# EAGLE design DAQ and eCVT (EAGLE 9.5.0)

## Sheet 1 of 3
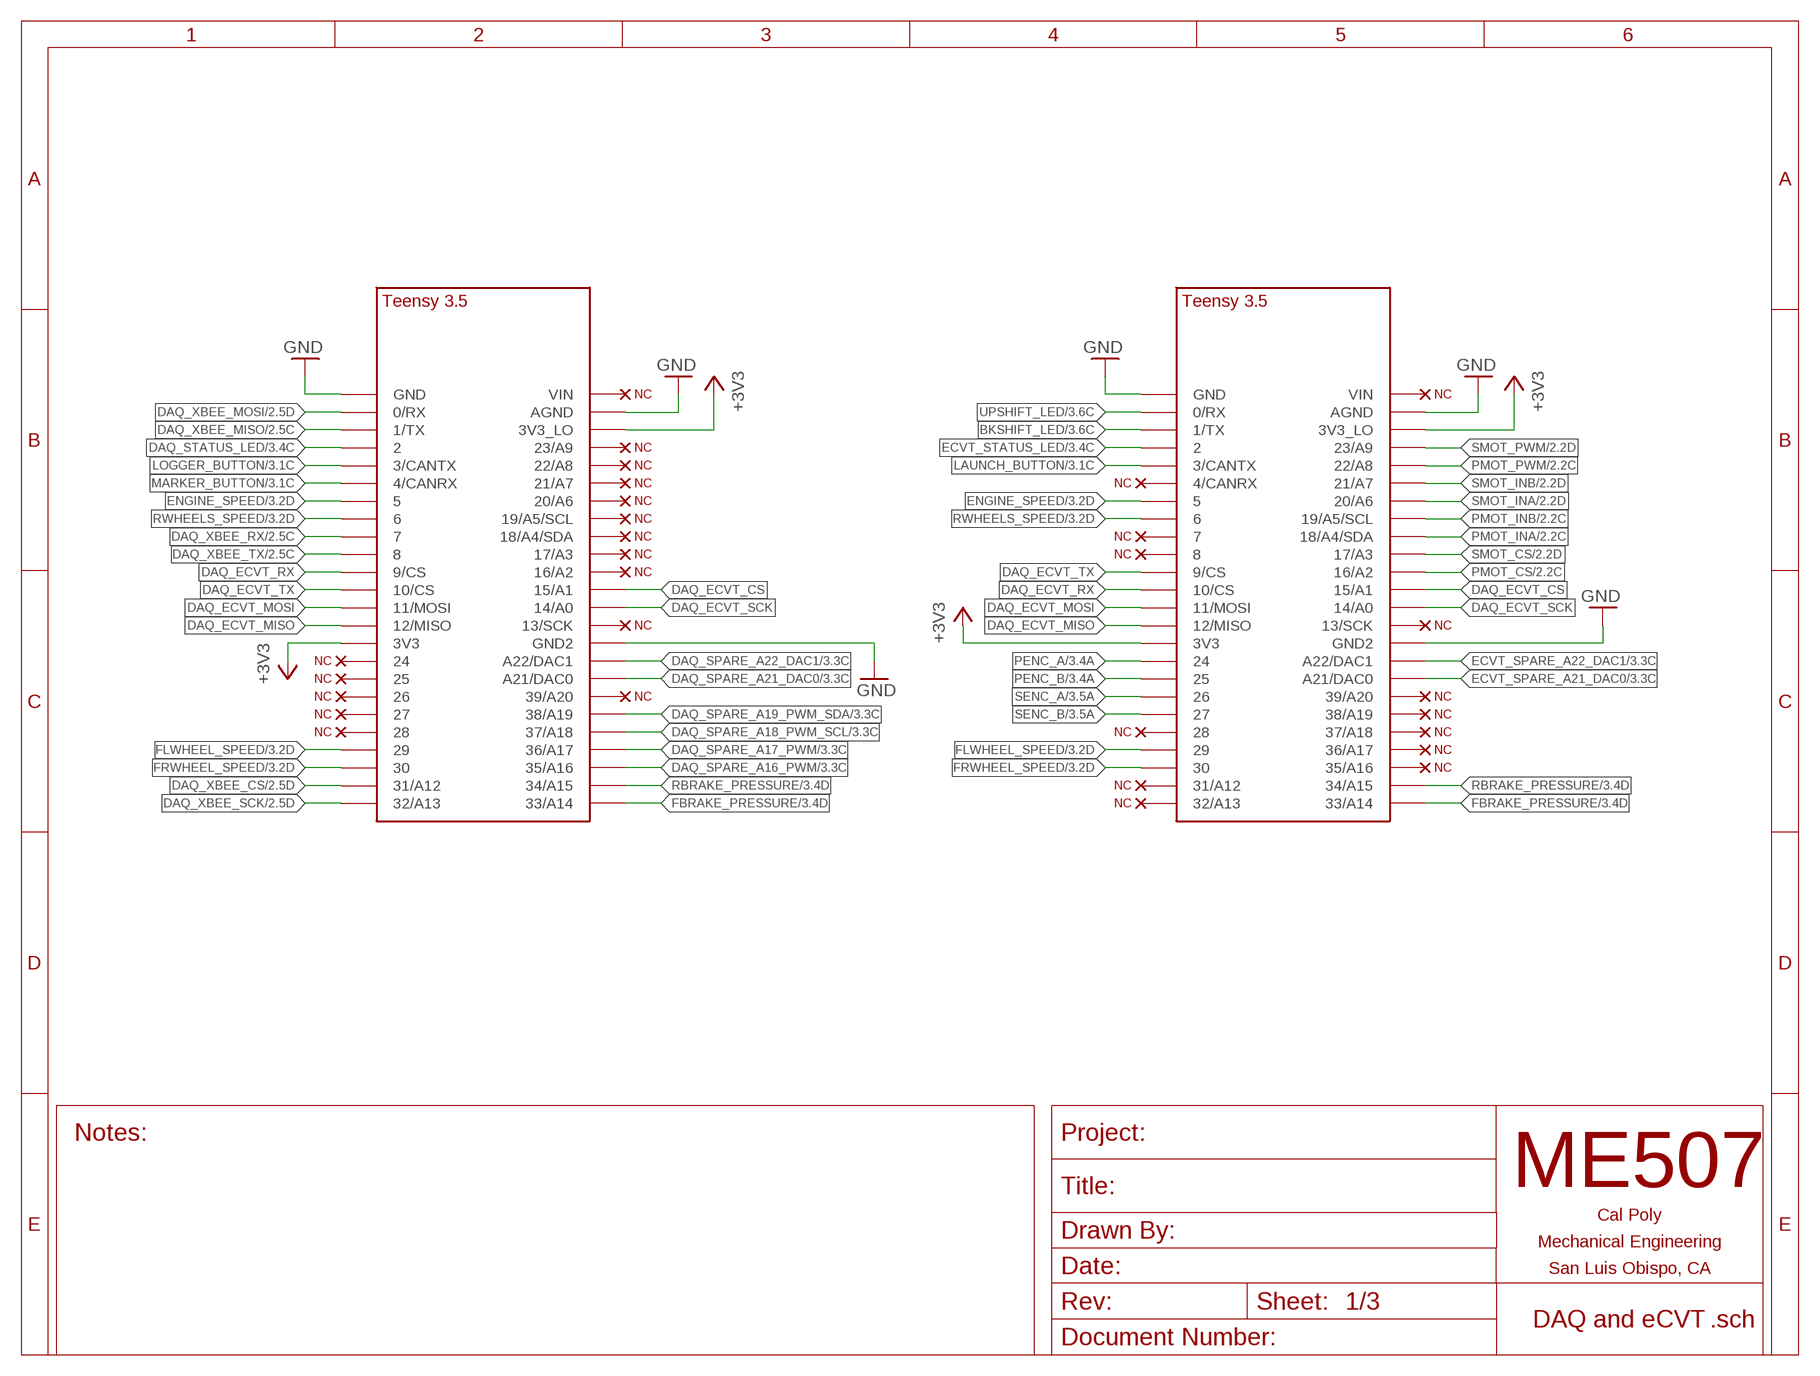
[diagram p0: schematic, sheet 1]

### Parts
U$1  NC  (no package)
U$2  NC  (no package)
U$3  NC  (no package)
U$4  NC  (no package)
U$5  NC  (no package)
U$6  NC  (no package)
U$7  NC  (no package)
U$8  NC  (no package)
U$9  NC  (no package)
U$10  NC  (no package)
U$11  NC  (no package)
U$12  NC  (no package)
U$13  NC  (no package)
U$14  NC  (no package)
U$15  NC  (no package)
U$16  NC  (no package)
U$17  NC  (no package)
U$22  NC  (no package)
U$23  NC  (no package)
U$24  NC  (no package)
U$25  NC  (no package)
U$26  NC  (no package)
U$27  NC  (no package)
U$31  TEENSY_3.5_BAJA  [TEENSY_3.5_BAJA]
U$32  NC  (no package)
U$33  TEENSY_3.5_BAJA  [TEENSY_3.5_BAJA]
U$40  NC  (no package)
U$41  NC  (no package)
U$42  NC  (no package)
U$55  NC  (no package)
U$56  NC  (no package)

### Nets
+3V3: U$31.3V3_LO U$33.3V3_LO ; also sheet 2,3
BKSHIFT_LED: U$33.1/TX ; also sheet 3
DAQ_ECVT_CS: U$31.15/A1 U$33.15/A1
DAQ_ECVT_MISO: U$31.12/MISO U$33.12/MISO
DAQ_ECVT_MOSI: U$31.11/MOSI U$33.11/MOSI
DAQ_ECVT_RX: U$31.9/CS U$33.10/CS
DAQ_ECVT_SCK: U$31.14/A0 U$33.14/A0
DAQ_ECVT_TX: U$31.10/CS U$33.9/CS
DAQ_SPARE_A16_PWM: U$31.35/A16 ; also sheet 3
DAQ_SPARE_A17_PWM: U$31.36/A17 ; also sheet 3
DAQ_SPARE_A18_PWM_SCL: U$31.37/A18 ; also sheet 3
DAQ_SPARE_A19_PWM_SDA: U$31.38/A19 ; also sheet 3
DAQ_SPARE_A21_DAC0: U$31.21/DAC0(A21/DAC0) ; also sheet 3
DAQ_SPARE_A22_DAC1: U$31.A22/DAC1 ; also sheet 3
DAQ_STATUS_LED: U$31.2 ; also sheet 3
DAQ_XBEE_CS: U$31.31/A12 ; also sheet 2
DAQ_XBEE_MISO: U$31.1/TX ; also sheet 2
DAQ_XBEE_MOSI: U$31.0/RX ; also sheet 2
DAQ_XBEE_RX: U$31.7 ; also sheet 2
DAQ_XBEE_SCK: U$31.32/A13 ; also sheet 2
DAQ_XBEE_TX: U$31.8 ; also sheet 2
ECVT_SPARE_A21_DAC0: U$33.21/DAC0(A21/DAC0) ; also sheet 3
ECVT_SPARE_A22_DAC1: U$33.A22/DAC1 ; also sheet 3
ECVT_STATUS_LED: U$33.2 ; also sheet 3
ENGINE_SPEED: U$31.5 U$33.5 ; also sheet 3
FBRAKE_PRESSURE: U$31.33/A14 U$33.33/A14 ; also sheet 3
FLWHEEL_SPEED: U$31.29 U$33.29 ; also sheet 3
FRWHEEL_SPEED: U$31.30 U$33.30 ; also sheet 3
GND: U$31.AGND U$31.GND U$31.GND2 U$33.AGND U$33.GND U$33.GND2 ; also sheet 2,3
LAUNCH_BUTTON: U$33.3/CANTX ; also sheet 3
LOGGER_BUTTON: U$31.3/CANTX ; also sheet 3
MARKER_BUTTON: U$31.4/CANRX ; also sheet 3
N$2: U$31.3V3 ; supply symbol labelled +3V3
N$3: U$4.D U$31.13/SCK
N$4: U$5.D U$31.16/A2
N$5: U$6.D U$31.17/A3
N$6: U$7.D U$31.18/A4/SDA
N$7: U$8.D U$31.19/A5/SCL
N$8: U$9.D U$31.20/A6
N$9: U$10.D U$31.21/A7
N$10: U$11.D U$31.22/A8
N$11: U$12.D U$31.23/A9
N$12: U$13.D U$31.24
N$13: U$14.D U$31.25
N$14: U$15.D U$31.26
N$15: U$16.D U$31.27
N$16: U$17.D U$31.28
N$17: U$22.D U$31.39/A20
N$18: U$31.VIN U$56.D
N$19: U$33.3V3 ; supply symbol labelled +3V3
N$20: U$3.D U$33.13/SCK
N$22: U$33.39/A20 U$40.D
N$23: U$33.7 U$41.D
N$24: U$33.8 U$42.D
N$25: U$23.D U$33.28
N$26: U$24.D U$33.35/A16
N$27: U$25.D U$33.36/A17
N$28: U$26.D U$33.37/A18
N$29: U$27.D U$33.38/A19
N$30: U$33.VIN U$55.D
N$31: U$1.D U$33.4/CANRX
N$32: U$2.D U$33.31/A12
N$33: U$32.D U$33.32/A13
PENC_A: U$33.24 ; also sheet 3
PENC_B: U$33.25 ; also sheet 3
PMOT_CS: U$33.16/A2 ; also sheet 2
PMOT_INA: U$33.18/A4/SDA ; also sheet 2
PMOT_INB: U$33.19/A5/SCL ; also sheet 2
PMOT_PWM: U$33.22/A8 ; also sheet 2
RBRAKE_PRESSURE: U$31.34/A15 U$33.34/A15 ; also sheet 3
RWHEELS_SPEED: U$31.6 U$33.6 ; also sheet 3
SENC_A: U$33.26 ; also sheet 3
SENC_B: U$33.27 ; also sheet 3
SMOT_CS: U$33.17/A3 ; also sheet 2
SMOT_INA: U$33.20/A6 ; also sheet 2
SMOT_INB: U$33.21/A7 ; also sheet 2
SMOT_PWM: U$33.23/A9 ; also sheet 2
UPSHIFT_LED: U$33.0/RX ; also sheet 3

## Sheet 2 of 3
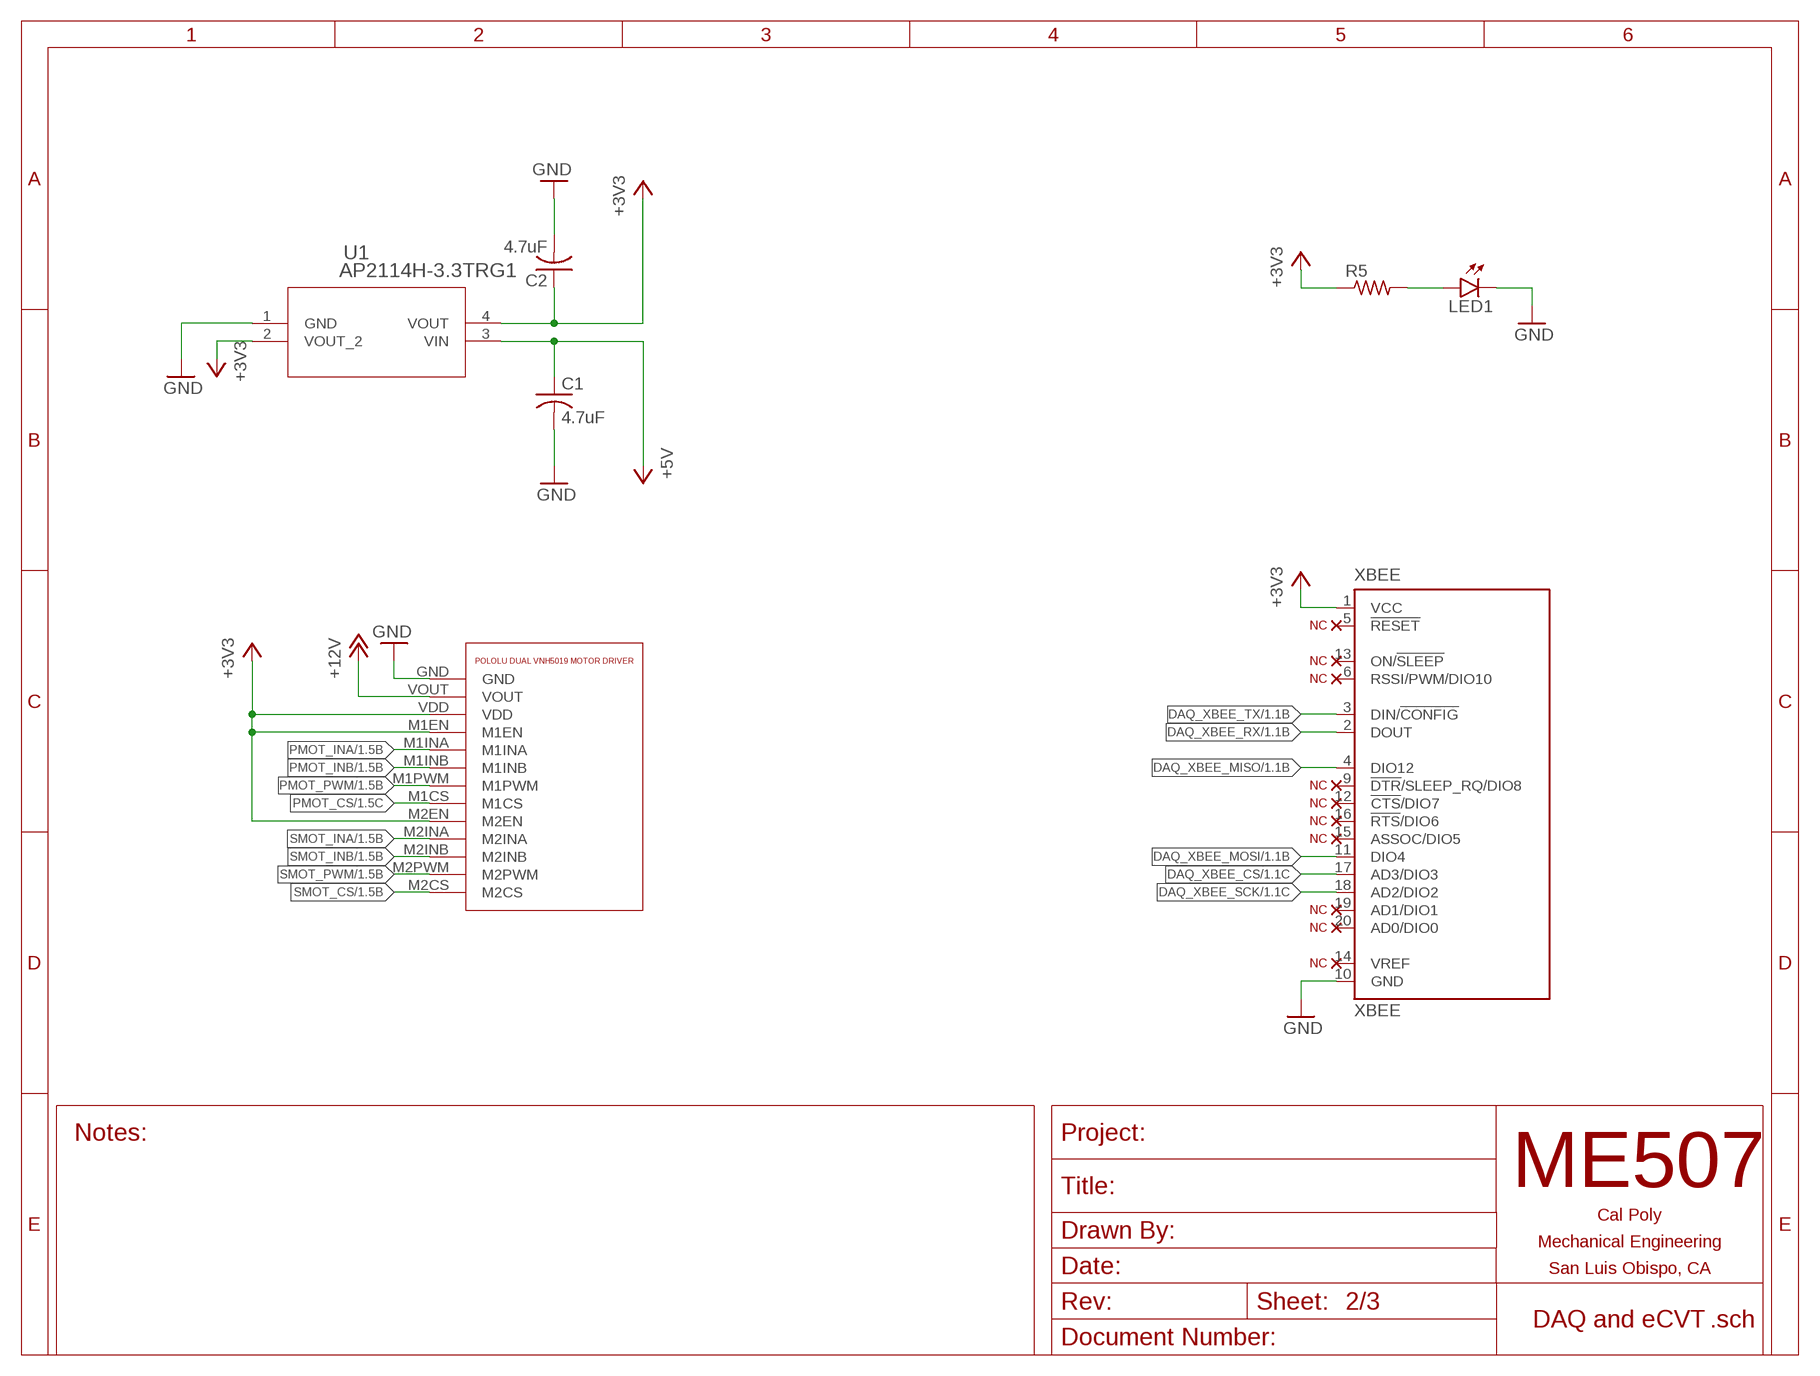
[diagram p1: schematic, sheet 2]

### Parts
C1  4.7uF  C-USC0805  [C0805]
C2  4.7uF  C-USC0805  [C0805]
LED1  LEDCHIPLED_0805  [CHIPLED_0805]
R5  R-US_R0805  [R0805]
U1  AP2114H-3.3TRG1  [SOT-223]
U$28  POLOLU_DUAL_VNH5019_BAJA  [POLOLU_DUAL_VNH5019_BAJA]
U$34  NC  (no package)
U$35  NC  (no package)
U$47  NC  (no package)
U$48  NC  (no package)
U$49  NC  (no package)
U$50  NC  (no package)
U$51  NC  (no package)
U$52  NC  (no package)
U$53  NC  (no package)
U$54  NC  (no package)
XBEE  XBEE  [XBEE]

### Nets
+3V3: C2.1 R5.1 U1.2(VOUT_2) U1.4(VOUT) U$28.M1EN U$28.M2EN U$28.VDD XBEE.1(VCC) ; also sheet 1,3
+5V: C1.1 U1.3(VIN) ; also sheet 3
+12V: U$28.VOUT ; also sheet 3
DAQ_XBEE_CS: XBEE.17(AD3/DIO3) ; also sheet 1
DAQ_XBEE_MISO: XBEE.4(DIO12) ; also sheet 1
DAQ_XBEE_MOSI: XBEE.11(DIO4) ; also sheet 1
DAQ_XBEE_RX: XBEE.2(DOUT) ; also sheet 1
DAQ_XBEE_SCK: XBEE.18(AD2/DIO2) ; also sheet 1
DAQ_XBEE_TX: XBEE.3(DIN/!CONFIG) ; also sheet 1
GND: C1.2 C2.2 LED1.C U1.1(GND) U$28.GND XBEE.10(GND) ; also sheet 1,3
N$1: LED1.A R5.2
N$43: U$34.D XBEE.5(!RESET)
N$45: U$35.D XBEE.13(ON/!SLEEP)
N$46: U$47.D XBEE.6(RSSI/PWM/DIO10)
N$47: U$48.D XBEE.9(!DTR!/SLEEP_RQ/DIO8)
N$48: U$49.D XBEE.12(!CTS!/DIO7)
N$49: U$50.D XBEE.16(!RTS!/DIO6)
N$50: U$51.D XBEE.15(ASSOC/DIO5)
N$51: U$52.D XBEE.19(AD1/DIO1)
N$52: U$53.D XBEE.20(AD0/DIO0)
N$53: U$54.D XBEE.14(VREF)
PMOT_CS: U$28.M1CS ; also sheet 1
PMOT_INA: U$28.M1INA ; also sheet 1
PMOT_INB: U$28.M1INB ; also sheet 1
PMOT_PWM: U$28.M1PWM ; also sheet 1
SMOT_CS: U$28.M2CS ; also sheet 1
SMOT_INA: U$28.M2INA ; also sheet 1
SMOT_INB: U$28.M2INB ; also sheet 1
SMOT_PWM: U$28.M2PWM ; also sheet 1

## Sheet 3 of 3
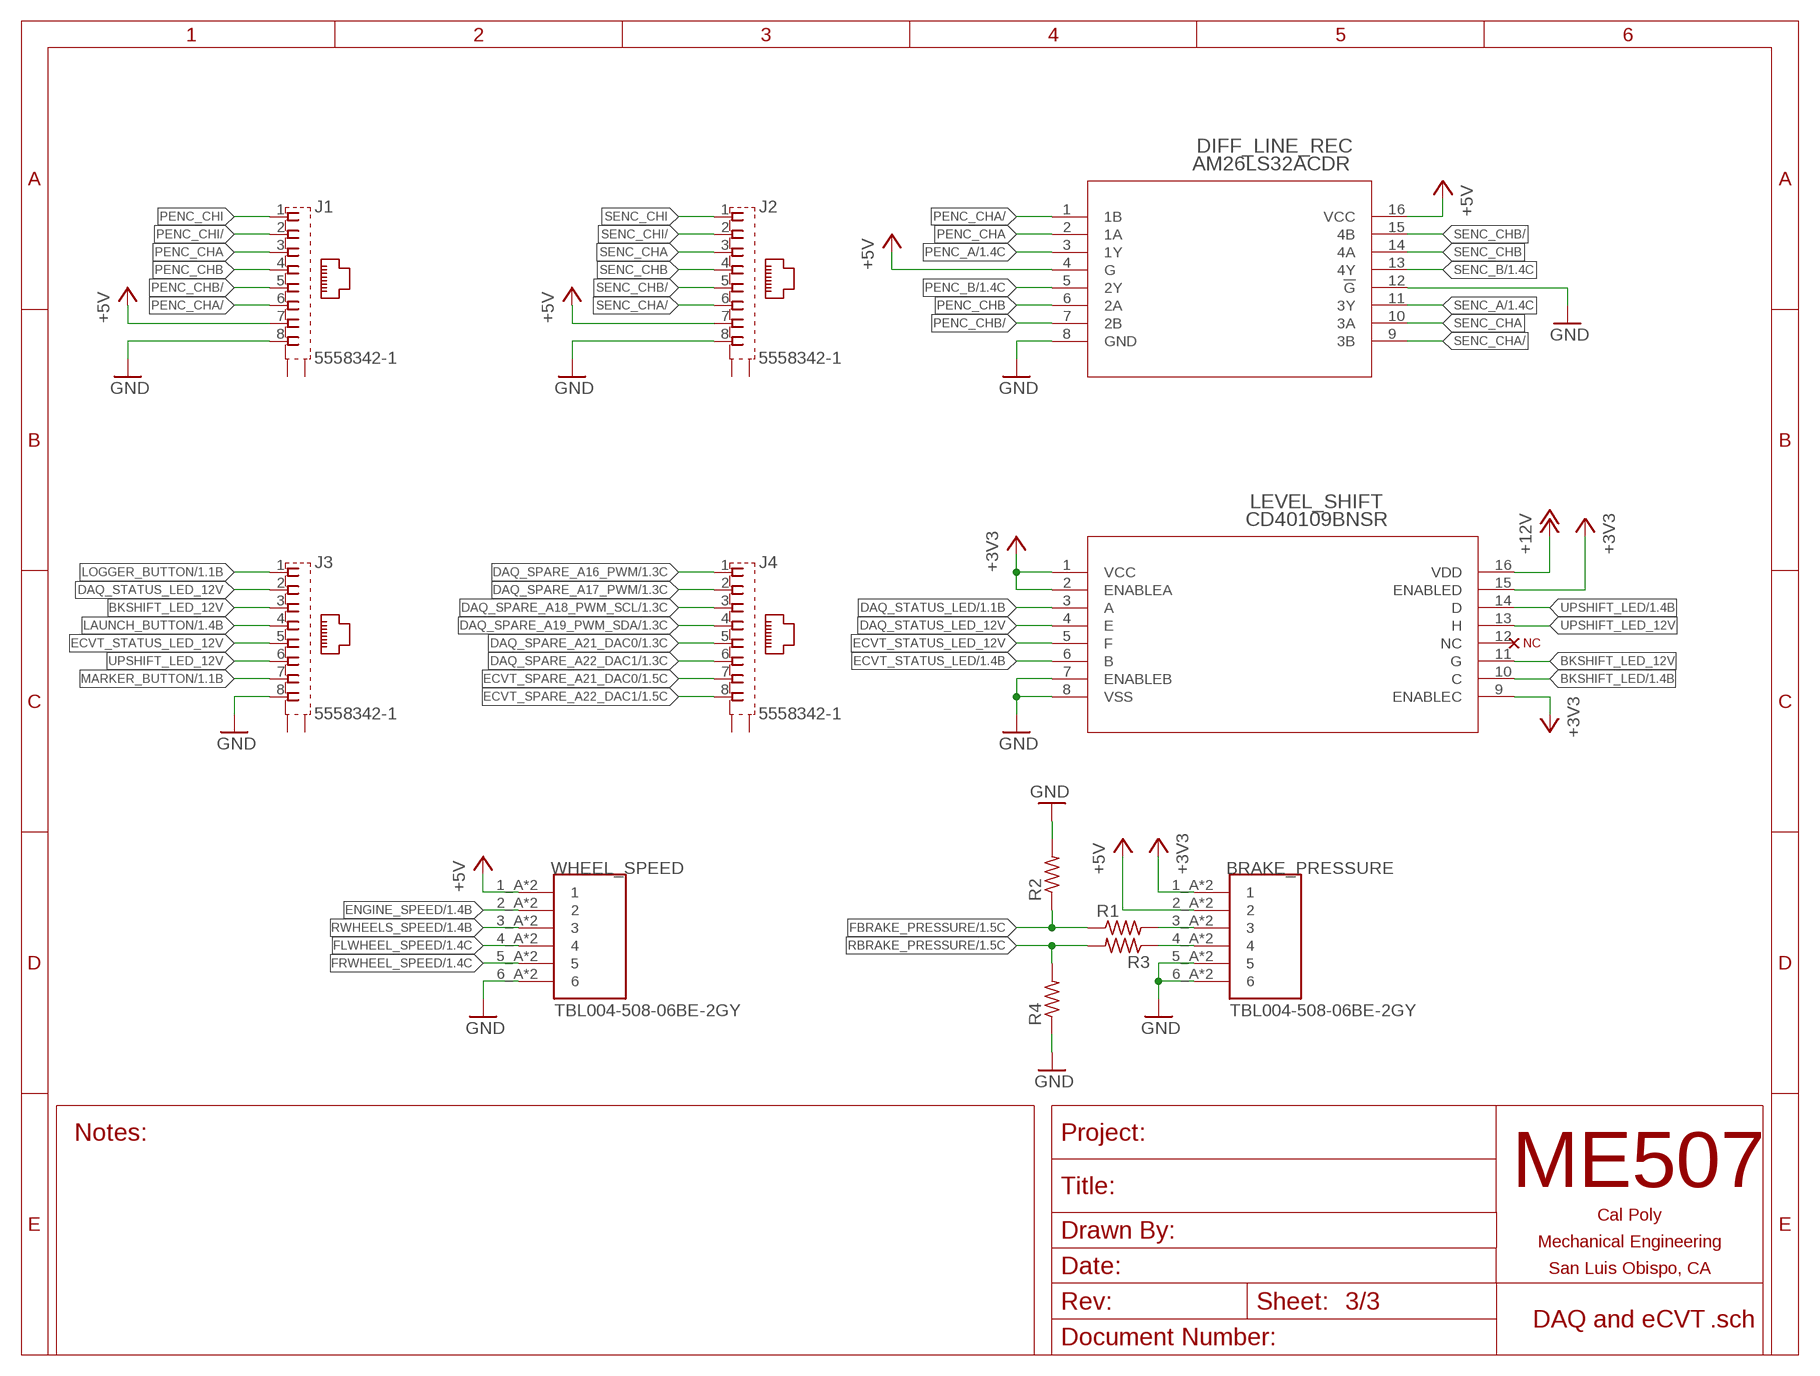
[diagram p2: schematic, sheet 3]

### Parts
BRAKE_PRESSURE  TBL004-508-06BE-2GY  [CUI_TBL004-508-06BE-2GY]
DIFF_LINE_REC  AM26LS32ACDR  [D16]
J1  5558342-1  [TE_5558342-1]
J2  5558342-1  [TE_5558342-1]
J3  5558342-1  [TE_5558342-1]
J4  5558342-1  [TE_5558342-1]
LEVEL_SHIFT  CD40109BNSR  [NS16]
R1  R-US_0204/7  [0204/7]
R2  R-US_0204/7  [0204/7]
R3  R-US_0204/7  [0204/7]
R4  R-US_0204/7  [0204/7]
U$30  NC  (no package)
WHEEL_SPEED  TBL004-508-06BE-2GY  [CUI_TBL004-508-06BE-2GY]

### Nets
+3V3: BRAKE_PRESSURE.1_A BRAKE_PRESSURE.1_B LEVEL_SHIFT.1(VCC) LEVEL_SHIFT.2(ENABLEA) LEVEL_SHIFT.9(ENABLEC) LEVEL_SHIFT.15(ENABLED) ; also sheet 1,2
+5V: BRAKE_PRESSURE.2_A BRAKE_PRESSURE.2_B DIFF_LINE_REC.4(G) DIFF_LINE_REC.16(VCC) J1.7 J2.7 WHEEL_SPEED.1_A WHEEL_SPEED.1_B ; also sheet 2
+12V: LEVEL_SHIFT.16(VDD) ; also sheet 2
BKSHIFT_LED: LEVEL_SHIFT.10(C) ; also sheet 1
BKSHIFT_LED_12V: J3.3 LEVEL_SHIFT.11(G)
DAQ_SPARE_A16_PWM: J4.1 ; also sheet 1
DAQ_SPARE_A17_PWM: J4.2 ; also sheet 1
DAQ_SPARE_A18_PWM_SCL: J4.3 ; also sheet 1
DAQ_SPARE_A19_PWM_SDA: J4.4 ; also sheet 1
DAQ_SPARE_A21_DAC0: J4.5 ; also sheet 1
DAQ_SPARE_A22_DAC1: J4.6 ; also sheet 1
DAQ_STATUS_LED: LEVEL_SHIFT.3(A) ; also sheet 1
DAQ_STATUS_LED_12V: J3.2 LEVEL_SHIFT.4(E)
ECVT_SPARE_A21_DAC0: J4.7 ; also sheet 1
ECVT_SPARE_A22_DAC1: J4.8 ; also sheet 1
ECVT_STATUS_LED: LEVEL_SHIFT.6(B) ; also sheet 1
ECVT_STATUS_LED_12V: J3.5 LEVEL_SHIFT.5(F)
ENGINE_SPEED: WHEEL_SPEED.2_A WHEEL_SPEED.2_B ; also sheet 1
FBRAKE_PRESSURE: R1.1 R2.1 ; also sheet 1
FBRAKE_PRESSURE_W/O_RES: BRAKE_PRESSURE.3_A BRAKE_PRESSURE.3_B R1.2
FLWHEEL_SPEED: WHEEL_SPEED.4_A WHEEL_SPEED.4_B ; also sheet 1
FRWHEEL_SPEED: WHEEL_SPEED.5_A WHEEL_SPEED.5_B ; also sheet 1
GND: BRAKE_PRESSURE.5_A BRAKE_PRESSURE.5_B BRAKE_PRESSURE.6_A BRAKE_PRESSURE.6_B DIFF_LINE_REC.8(GND) DIFF_LINE_REC.12(!G) J1.8 J2.8 J3.8 LEVEL_SHIFT.7(ENABLEB) LEVEL_SHIFT.8(VSS) R2.2 R4.1 WHEEL_SPEED.6_A WHEEL_SPEED.6_B ; also sheet 1,2
LAUNCH_BUTTON: J3.4 ; also sheet 1
LOGGER_BUTTON: J3.1 ; also sheet 1
MARKER_BUTTON: J3.7 ; also sheet 1
N$21: LEVEL_SHIFT.12(NC) U$30.D
PENC_A: DIFF_LINE_REC.3(1Y) ; also sheet 1
PENC_B: DIFF_LINE_REC.5(2Y) ; also sheet 1
PENC_CHA: DIFF_LINE_REC.2(1A) J1.3
PENC_CHA/: DIFF_LINE_REC.1(1B) J1.6
PENC_CHB: DIFF_LINE_REC.6(2A) J1.4
PENC_CHB/: DIFF_LINE_REC.7(2B) J1.5
PENC_CHI: J1.1
PENC_CHI/: J1.2
RBRAKE_PRESSURE: R3.2 R4.2 ; also sheet 1
RBRAKE_PRESSURE_W/O_RES: BRAKE_PRESSURE.4_A BRAKE_PRESSURE.4_B R3.1
RWHEELS_SPEED: WHEEL_SPEED.3_A WHEEL_SPEED.3_B ; also sheet 1
SENC_A: DIFF_LINE_REC.11(3Y) ; also sheet 1
SENC_B: DIFF_LINE_REC.13(4Y) ; also sheet 1
SENC_CHA: DIFF_LINE_REC.10(3A) J2.3
SENC_CHA/: DIFF_LINE_REC.9(3B) J2.6
SENC_CHB: DIFF_LINE_REC.14(4A) J2.4
SENC_CHB/: DIFF_LINE_REC.15(4B) J2.5
SENC_CHI: J2.1
SENC_CHI/: J2.2
UPSHIFT_LED: LEVEL_SHIFT.14(D) ; also sheet 1
UPSHIFT_LED_12V: J3.6 LEVEL_SHIFT.13(H)
Unconnected: J1.SH1(S1) J1.SH2(S2) J2.SH1(S1) J2.SH2(S2) J3.SH1(S1) J3.SH2(S2) J4.SH1(S1) J4.SH2(S2)

## Library data of the parts
BRAKE_PRESSURE WHEEL_SPEED = Screwless Terminal 6-Pole:TBL004-508-06BE-2GY; MANUFACTURER: CUI; STANDARD: Manufacturer Recommendations
C1 C2 = rcl:C-US: CAPACITOR, American symbol; SPICEPREFIX: C
DIFF_LINE_REC = Quad. Diff. Line Receiver:AM26LS32ACDR; BUILT_BY: EMA_UL_Team; MANUFACTURER: Texas Instruments; MANUFACTURER_PART_NUMBER: AM26LS32ACDR; VENDOR: Texas Instruments
J1-J4 = RJ45:5558342-1: CONN MOD JACK 8P8C R/A SHIELDED; COMMENT: 5558342-1; DESCRIPTION: Conn RJ-45 F 8 POS 2.54mm Solder RA Thru-Hole 8 Terminal 1 Port Cat 5 Box/Tray; DIGI-KEY_PART_NUMBER: A31466-ND; DIGI-KEY_PURCHASE_URL: https://www.digikey.com/product-detail/en/te-connectivity-amp-connectors/5558342-1/A31466-ND/769610?utm_source=snapeda&utm_medium=aggregator&utm_campaign=symbol; EU_ROHS_COMPLIANCE: Compliant; MF: TE Connectivity; MP: 5558342-1; PACKAGE: None; TE_PURCHASE_URL: https://www.te.com/usa-en/product-5558342-1.html?te_bu=Cor&te_type=disp&te_campaign=seda_glo_cor-seda-global-disp-prtnr-fy19-seda-model-bom-cta_sma-317_1&elqCampaignId=32493
LED1 = led:LED: LED OSRAM: - CHIPLED LG R971, LG N971, LY N971, LG Q971, LY Q971, LO R971, LY R971 LH N974, LH R974 LS Q976, LO Q976, LY Q976 LO Q996 - Hyper CHIPLED LW Q18S LB Q993, LB Q99A, LB R99A - SideLED LS A670, LO A670, LY A670, LG A670, LP A670 LB A673, LV A673, LT A673, LW A673 LH A674 LY A675 LS A676, LA A676, LO A676, LY A676, LW A676 LS A679, LY A679, LG A679 - Hyper Micro SIDELED® LS Y876, LA Y876, LO Y876, LY Y876 LT Y87S - SmartLED LW L88C, LW L88S LB L89C, LB L89S, LG L890 LS L89K, LO L89K, LY L89K LS L896, LA L896, LO L896, LY L896 - TOPLED LS T670, LO T670, LY T670, LG T670, LP T670 LSG T670, LSP T670, LSY T670, LOP T670, LYG T670 LG T671, LOG T671, LSG T671 LB T673, LV T673, LT T673, LW T673 LH T674 LS T676, LA T676, LO T676, LY T676, LB T676, LH T676, LSB T676, LW T676 LB T67C, LV T67C, LT T67C, LS T67K, LO T67K, LY T67K, LW E67C LS E67B, LA E67B, LO E67B, LY E67B, LB E67C, LV E67C, LT E67C LW T67C LS T679, LY T679, LG T679 LS T770, LO T770, LY T770, LG T770, LP T770 LB T773, LV T773, LT T773, LW T773 LH T774 LS E675, LA E675, LY E675, LS T675 LS T776, LA T776, LO T776, LY T776, LB T776 LHGB T686 LT T68C, LB T68C - Hyper Mini TOPLED® LB M676 - Mini TOPLED Santana® LG M470 LS M47K, LO M47K, LY M47K Source: http://www.osram.convergy.de LUXEON: - LUMILED® LXK2-PW12-R00, LXK2-PW12-S00, LXK2-PW14-U00, LXK2-PW14-V00 LXK2-PM12-R00, LXK2-PM12-S00, LXK2-PM14-U00 LXK2-PE12-Q00, LXK2-PE12-R00, LXK2-PE12-S00, LXK2-PE14-T00, LXK2-PE14-U00 LXK2-PB12-K00, LXK2-PB12-L00, LXK2-PB12-M00, LXK2-PB14-N00, LXK2-PB14-P00, LXK2-PB14-Q00 LXK2-PR12-L00, LXK2-PR12-M00, LXK2-PR14-Q00, LXK2-PR14-R00 LXK2-PD12-Q00, LXK2-PD12-R00, LXK2-PD12-S00 LXK2-PH12-R00, LXK2-PH12-S00 LXK2-PL12-P00, LXK2-PL12-Q00, LXK2-PL12-R00 Source: www.luxeon.com KINGBRIGHT: KA-3528ASYC Source: www.kingbright.com
LEVEL_SHIFT = Quad. Level Shifter:CD40109BNSR; BUILT_BY: EMA_UL_Team; MANUFACTURER: Texas Instruments; MANUFACTURER_PART_NUMBER: CD40109BNSR; VENDOR: Texas Instruments
R1-R5 = rcl:R-US_: RESISTOR, American symbol; SPICEPREFIX: R
U1 = Voltage Regulator 3.3V:AP2114H-3.3TRG1; BUILT_BY: EMA_UL_Team; MANUFACTURER_PART_NUMBER: AP2114H-3.3TRG1; VENDOR: Diodes Inc
U$1-U$17 U$22-U$27 U$30 U$32 U$34 U$35 U$40-U$42 U$47-U$56 = ME507:NC
U$28 = Pololo Dual VNH5019:POLOLU_DUAL_VNH5019_BAJA
U$31 U$33 = Teensy:TEENSY_3.5_BAJA
XBEE = Xbee:XBEE: XBee (TM) /XBee-PRO(TM) OEM RF Modules Source: MaxStream, Inc. xbee_productmanual.pdf; MPN: XBP24-Z7UIT-004; OC_FARNELL: 1751799; OC_NEWARK: 34R5507

## Board
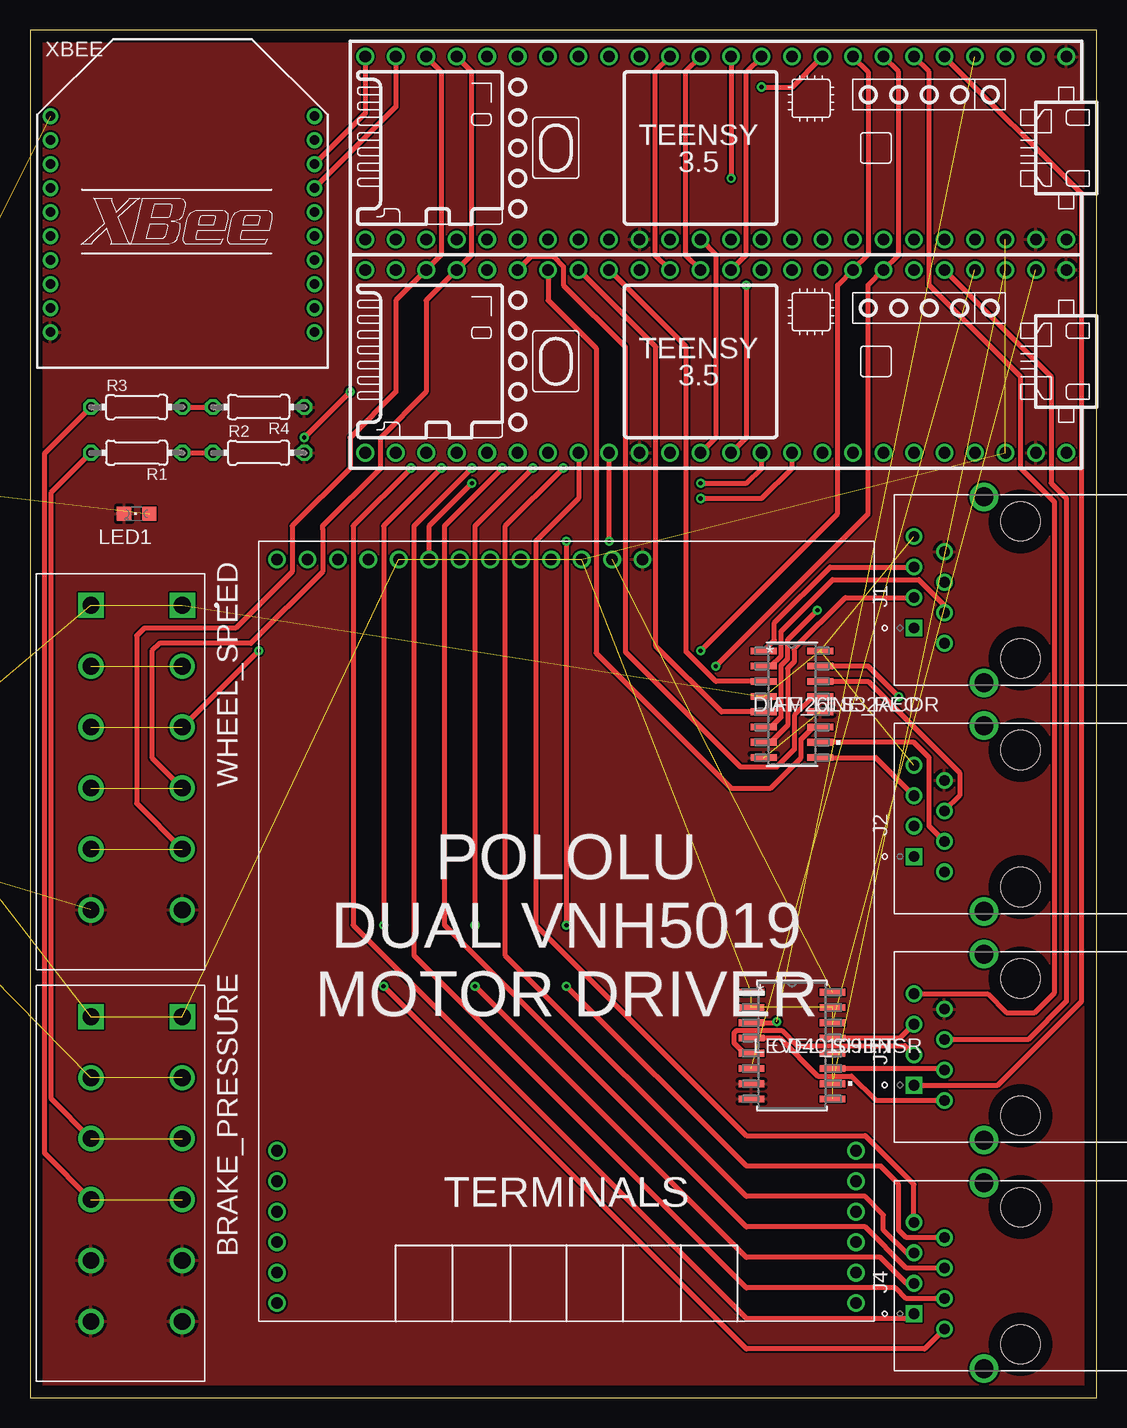
[diagram p3: board, top side]
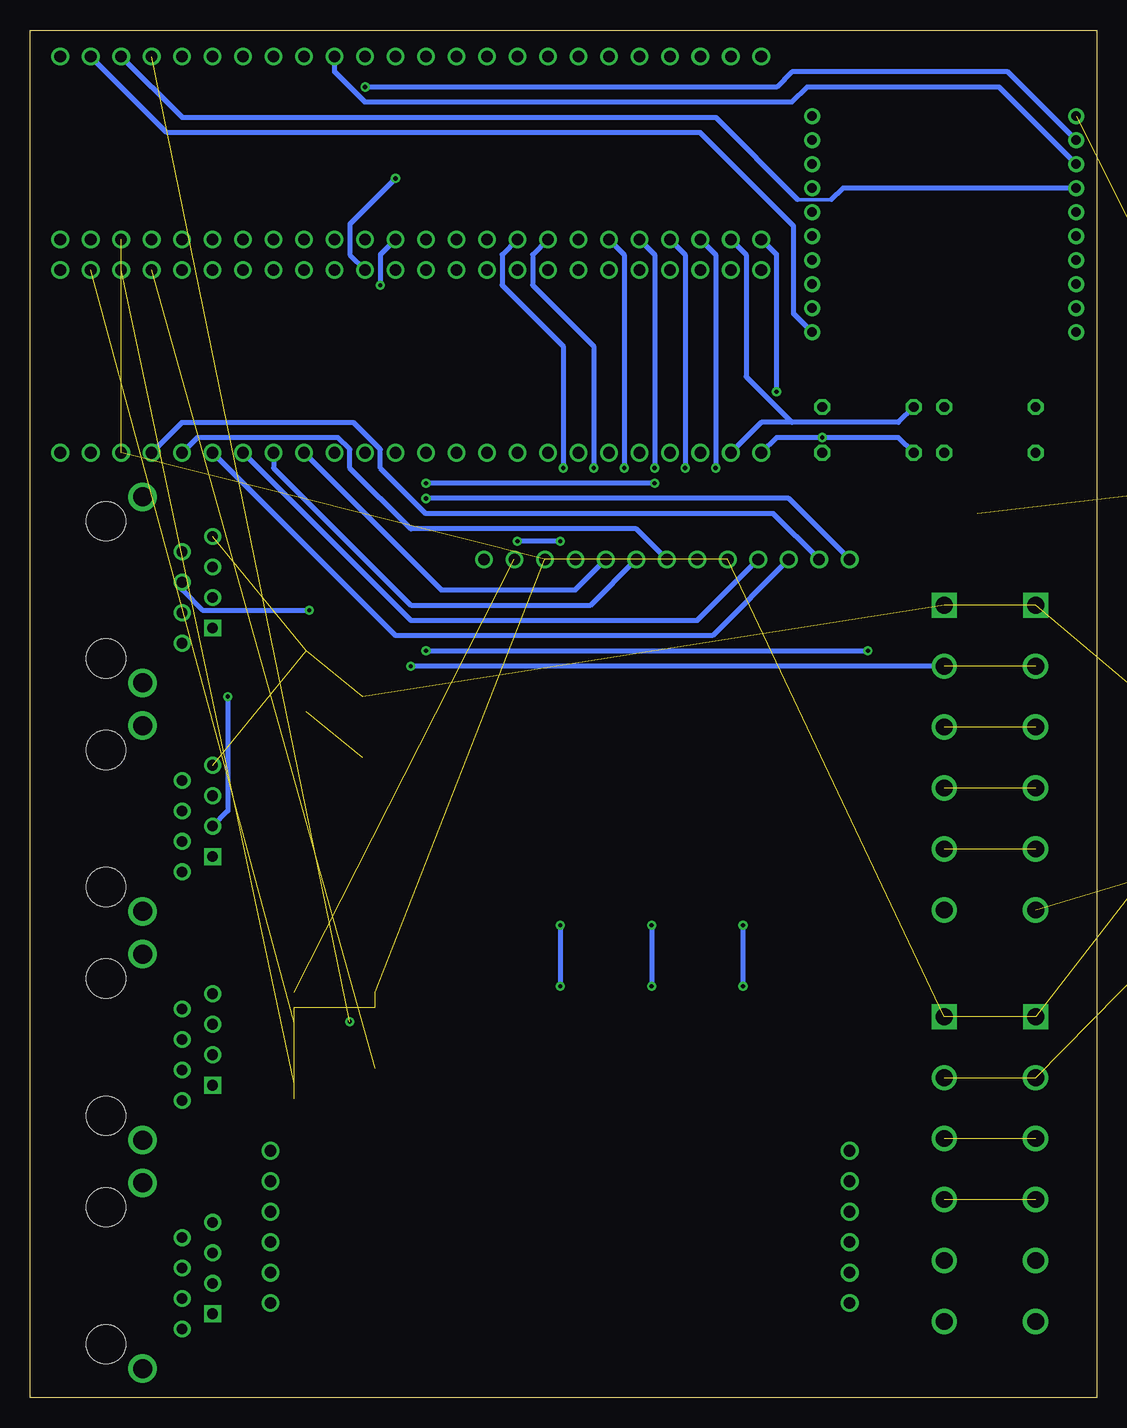
[diagram p4: board, bottom side, seen from below]

Size 88.88 x 113.97 mm. Coordinates in mm from the lower left corner, seen from the top.
Outline: 0,0 88.88,0 88.88,113.97 0,113.97 0,0
Copper layers (1*16): Top 0.035mm / dielectric 1.5mm / Bottom 0.035mm
Design rules "default": minimum track width 6mil, minimum drill 0.35mm, track to track 6mil, track to pad 6mil, pad to pad 6mil, via to via 6mil, smd to smd 6mil, copper to edge 40mil, drill to drill 6mil, minimum pad ring 10mil, minimum via ring 8mil, stop-mask expansion 4mil, vias tented up to drill 0mil, thermal gap 10mil

### Footprints (pad centres in the part's own frame; a part is rotated, then mirrored left to right if it is on the bottom)
CUI_TBL004-508-06BE-2GY = drill 1.4 square: 1_A 0,0; 1_B 0,-7.62 | drill 1.4: 2_A 5.08,0; 2_B 5.08,-7.62; 3_A 10.16,0; 3_B 10.16,-7.62; 4_A 15.24,0; 4_B 15.24,-7.62; 5_A 20.32,0; 5_B 20.32,-7.62; 6_A 25.4,0; 6_B 25.4,-7.62
C0805 = smd 1.3 x 1.5: 1 -0.95,0; 2 0.95,0
D16 = smd 2.184 x 0.559: 1 -2.362,4.445; 2 -2.362,3.175; 3 -2.362,1.905; 4 -2.362,0.635; 5 -2.362,-0.635; 6 -2.362,-1.905; 7 -2.362,-3.175; 8 -2.362,-4.445; 9 2.362,-4.445; 10 2.362,-3.175; 11 2.362,-1.905; 12 2.362,-0.635; 13 2.362,0.635; 14 2.362,1.905; 15 2.362,3.175; 16 2.362,4.445
TE_5558342-1 = drill 0.89 square: 1 -3.175,8.89 | drill 0.89: 2 -4.445,6.35; 3 -1.905,6.35; 4 0.635,6.35; 5 -0.635,8.89; 6 1.905,8.89; 7 4.445,8.89; 8 3.175,6.35 | drill 1.58: SH1 -7.745,3.05; SH2 7.745,3.05 | hole 3.25: -5.715,0; 5.715,0
CHIPLED_0805 = smd 1.2 x 1.2: A 0,-1.05; C 0,1.05
NS16 = smd 2.159 x 0.559: 1 -3.378,4.445; 2 -3.378,3.175; 3 -3.378,1.905; 4 -3.378,0.635; 5 -3.378,-0.635; 6 -3.378,-1.905; 7 -3.378,-3.175; 8 -3.378,-4.445; 9 3.378,-4.445; 10 3.378,-3.175; 11 3.378,-1.905; 12 3.378,-0.635; 13 3.378,0.635; 14 3.378,1.905; 15 3.378,3.175; 16 3.378,4.445
0204/7 = drill 0.813 octagon: 1 -3.81,0; 2 3.81,0
R0805 = smd 1.3 x 1.5: 1 -0.95,0; 2 0.95,0
SOT-223 = smd 0.851 x 1.761: 1 -2.3,-3.025; 2 0,-3.025; 3 2.3,-3.025 | smd 3.151 x 1.761: 4 0,3.025
POLOLU_DUAL_VNH5019_BAJA = drill 0.965: 0 49.784,1.524; 1 49.784,4.064; 2 49.784,6.604; 3 49.784,9.144; 4 49.784,11.684; 5 49.784,14.224; 14 1.524,14.224; 15 1.524,11.684; 16 1.524,9.144; 17 1.524,6.604; 20 1.524,4.064; 21 1.524,1.524; GND 32.004,63.5; M1CS 14.224,63.5; M1EN 24.384,63.5; M1INA 21.844,63.5; M1INB 19.304,63.5; M1PWM 16.764,63.5; M2CS 1.524,63.5; M2EN 11.684,63.5; M2INA 9.144,63.5; M2INB 6.604,63.5; M2PWM 4.064,63.5; VDD 26.924,63.5; VOUT 29.464,63.5
TEENSY_3.5_BAJA = drill 0.965: 0/RX 3.81,1.27; 1/TX 6.35,1.27; 2 8.89,1.27; 3/CANTX 11.43,1.27; 3V3 36.83,1.27; 3V3_LO 6.35,16.51; 4/CANRX 13.97,1.27; 5 16.51,1.27; 6 19.05,1.27; 7 21.59,1.27; 8 24.13,1.27; 9/CS 26.67,1.27; 10/CS 29.21,1.27; 11/MOSI 31.75,1.27; 12/MISO 34.29,1.27; 13/SCK 34.29,16.51; 14/A0 31.75,16.51; 15/A1 29.21,16.51; 16/A2 26.67,16.51; 17/A3 24.13,16.51; 18/A4/SDA 21.59,16.51; 19/A5/SCL 19.05,16.51; 20/A6 16.51,16.51; 21/A7 13.97,16.51; 21/DAC0 41.91,16.51; 22/A8 11.43,16.51; 23/A9 8.89,16.51; 24 39.37,1.27; 25 41.91,1.27; 26 44.45,1.27; 27 46.99,1.27; 28 49.53,1.27; 29 52.07,1.27; 30 54.61,1.27; 31/A12 57.15,1.27; 32/A13 59.69,1.27; 33/A14 59.69,16.51; 34/A15 57.15,16.51; 35/A16 54.61,16.51; 36/A17 52.07,16.51; 37/A18 49.53,16.51; 38/A19 46.99,16.51; 39/A20 44.45,16.51; A22/DAC1 39.37,16.51; AGND 3.81,16.51; GND 1.27,1.27; GND2 36.83,16.51; VIN 1.27,16.51
XBEE = drill 0.8 pad 1.27: 1 -11,9; 2 -11,7; 3 -11,5; 4 -11,3; 5 -11,1; 6 -11,-1; 7 -11,-3; 8 -11,-5; 9 -11,-7; 10 -11,-9; 11 11,-9; 12 11,-7; 13 11,-5; 14 11,-3; 15 11,-1; 16 11,1; 17 11,3; 18 11,5; 19 11,7; 20 11,9

### Placement (x,y rotation side)
BRAKE_PRESSURE  12.7,31.75 270 top
C1  -12.7,45.72 0 top  (outside the outline)
C2  -12.7,55.88 0 top  (outside the outline)
DIFF_LINE_REC  63.5,57.78 0 top
J1  82.55,67.31 90 top
J2  82.55,48.26 90 top
J3  82.55,29.21 90 top
J4  82.55,10.16 90 top
LED1  8.89,73.66 90 top
LEVEL_SHIFT  63.5,29.34 0 top
R1  8.89,78.74 180 top
R2  19.05,78.74 0 top
R3  8.89,82.55 0 top
R4  19.05,82.55 180 top
R5  -12.7,76.2 0 top  (outside the outline)
U1  -12.7,50.8 270 top  (outside the outline)
U$28  19.05,6.35 0 top
U$31  87.63,113.03 180 top
U$33  87.63,95.25 180 top
WHEEL_SPEED  12.7,66.04 270 top
XBEE  12.7,97.79 0 top

### Tracks (layer width: path | path; a pad name or v marks a point on that pad's centre or on a via)
+3V3  (15 unrouted)
+5V  (9 unrouted)
+12V  (1 unrouted)
BKSHIFT_LED  (1 unrouted)
BKSHIFT_LED_12V
  Top 0.406: LEVEL_SHIFT.11 76.07,27.43 J3.3
DAQ_ECVT_CS  (via drill 0.35)
  Top 0.406: U$33.15/A1 59.69,80.01 v59.69,92.71
  Bottom 0.406: U$31.15/A1 59.69,95.25 v59.69,92.71
DAQ_ECVT_MISO
  Top 0.406: U$31.12/MISO 52.07,110.49 52.07,95.25 U$33.12/MISO
DAQ_ECVT_MOSI
  Top 0.406: U$31.11/MOSI 54.61,110.49 54.61,95.25 U$33.11/MOSI
DAQ_ECVT_RX
  Top 0.406: U$33.10/CS 59.69,95.25 59.69,110.49 U$31.9/CS
DAQ_ECVT_SCK
  Top 0.406: U$31.14/A0 57.15,95.25 57.15,80.01 U$33.14/A0
DAQ_ECVT_TX  (via drill 0.35)
  Top 0.406: U$31.10/CS v58.42,101.6
  Bottom 0.406: v58.42,101.6 62.23,97.79 62.23,95.25 U$33.9/CS
DAQ_SPARE_A16_PWM  (via drill 0.35)
  Top 0.406: J4.1 73.28,6.6 59.69,6.6 26.92,39.37 26.92,72.64 v31.75,77.47
  Bottom 0.406: U$31.35/A16 31.75,95.25 v31.75,77.47
DAQ_SPARE_A17_PWM  (via drill 0.35)
  Top 0.406: J4.2 74.55,4.06 59.69,4.06 v29.46,34.29 | v34.29,77.47 29.46,72.64 v29.46,39.37
  Bottom 0.406: U$31.36/A17 34.29,95.25 v34.29,77.47 | v29.46,39.37 v29.46,34.29
DAQ_SPARE_A18_PWM_SCL  (via drill 0.35)
  Top 0.406: J4.3 73.03,8.26 72.14,9.14 59.69,9.14 32,36.83 32,72.64 v36.83,77.47
  Bottom 0.406: U$31.37/A18 36.83,95.25 v36.83,77.47
DAQ_SPARE_A19_PWM_SDA  (via drill 0.35)
  Top 0.406: J4.4 73.03,10.79 69.6,14.22 59.69,14.22 34.54,39.37 34.54,72.64 v39.37,77.47
  Bottom 0.406: U$31.38/A19 39.37,95.25 v39.37,77.47
DAQ_SPARE_A21_DAC0  (via drill 0.35)
  Top 0.406: J4.5 73.03,9.53 70.87,11.68 59.69,11.68 v37.08,34.29 | v41.91,77.47 37.08,72.64 v37.08,39.37
  Bottom 0.406: U$31.21/DAC0 46.99,95.25 46.99,92.71 41.91,87.63 v41.91,77.47 | v37.08,39.37 v37.08,34.29
DAQ_SPARE_A22_DAC1  (via drill 0.35)
  Top 0.406: J4.6 73.03,12.06 71.12,13.97 71.12,15.24 69.6,16.76 59.69,16.76 39.62,36.83 39.62,72.64 v44.45,77.47
  Bottom 0.406: U$31.A22/DAC1 49.53,95.25 49.53,92.71 44.45,87.63 v44.45,77.47
DAQ_STATUS_LED  (via drill 0.35)  (1 unrouted)
  Top 0.406: LEVEL_SHIFT.3 62.13,31.24 v62.23,31.34
DAQ_STATUS_LED_12V
  Top 0.406: 59.53,29.97 LEVEL_SHIFT.4 62.48,29.97 65.65,26.8 68.46,26.8 70.49,24.77 J3.2
DAQ_XBEE_CS
  Top 0.406: U$31.31/A12 30.48,107.57 XBEE.17
DAQ_XBEE_MISO
  Bottom 0.305: 22.09,99.83 24.9,99.83
  Bottom 0.406: XBEE.4 21.13,100.79 22.09,99.83 | 24.9,99.83 31.75,106.68 76.2,106.68 U$31.1/TX
DAQ_XBEE_MOSI
  Bottom 0.406: XBEE.11 25.24,90.33 25.24,97.63 33.02,105.41 77.47,105.41 U$31.0/RX
DAQ_XBEE_RX  (via drill 0.35)
  Top 0.406: v60.96,109.22 63.5,109.22 U$31.7
  Bottom 0.406: XBEE.2 7.4,110.49 25.4,110.49 26.67,109.22 v60.96,109.22
DAQ_XBEE_SCK
  Top 0.406: U$31.32/A13 27.94,107.03 XBEE.18
DAQ_XBEE_TX
  Bottom 0.406: XBEE.3 8.13,109.22 24.13,109.22 25.4,107.95 60.96,107.95 63.5,110.49 U$31.8
ECVT_SPARE_A21_DAC0
  Top 0.406: J4.7 73.66,17.78 69.6,21.84 59.69,21.84 42.16,39.37 42.16,71.37 45.72,74.93 U$33.21/DAC0
ECVT_SPARE_A22_DAC1  (via drill 0.35)
  Top 0.406: J4.8 73.03,13.34 72.39,13.97 72.39,17.78 70.87,19.3 59.69,19.3 v44.7,34.29 | v48.26,71.37 U$33.A22/DAC1 | v44.7,71.37 v44.7,39.37
  Bottom 0.406: v44.7,71.37 v48.26,71.37 | v44.7,39.37 v44.7,34.29
ECVT_STATUS_LED  (1 unrouted)
ECVT_STATUS_LED_12V
  Top 0.406: J3.5 72.9,29.34 63.9,29.34 62.63,30.61 58.9,30.61 58.69,30.4 58.69,29.55 59.53,28.7 LEVEL_SHIFT.5
ENGINE_SPEED  (via drill 0.35)  (1 unrouted)
  Top 0.406: v57.15,60.96 69.85,73.66 69.85,92.71 U$33.5 72.39,95.25 72.39,110.49 U$31.5
  Bottom 0.406: WHEEL_SPEED.2_A v57.15,60.96
FBRAKE_PRESSURE  (via drill 0.35)
  Top 0.406: R1.1 R2.1 | v26.67,83.82 v22.86,80.01
  Bottom 0.406: R2.1 16.51,80.01 v22.86,80.01 26.67,80.01 U$33.33/A14 | U$31.33/A14 26.67,95.25 v26.67,83.82
FBRAKE_PRESSURE_W/O_RES  (1 unrouted)
  Top 0.406: BRAKE_PRESSURE.3_B 1.78,24.89 1.78,75.44 R1.2
FLWHEEL_SPEED  (1 unrouted)
  Top 0.406: U$31.29 36.83,110.49 36.83,95.25 U$33.29 33.02,91.44 33.02,83.82 29.21,80.01 29.21,77.47 24.38,72.64 24.38,72.39 24.38,68.83 18.41,62.87 10.79,62.87 10.16,62.23 10.16,53.34 WHEEL_SPEED.4_A
FRWHEEL_SPEED  (1 unrouted)
  Top 0.406: U$31.30 34.29,110.49 34.29,95.25 U$33.30 30.48,91.44 30.48,83.82 26.67,80.01 26.67,77.47 21.84,72.64 21.84,68.83 17.14,64.14 9.53,64.14 8.89,63.5 8.89,49.53 WHEEL_SPEED.5_A
GND  (4 unrouted)
  pour Top: -1.27,-1.27 90.17,-1.27 90.17,115.57 -1.27,115.57
LAUNCH_BUTTON
  Top 0.406: J3.4 83.19,29.84 86.36,33.02 86.36,74.93 85.09,76.2 85.09,85.09 U$33.3/CANTX
LOGGER_BUTTON
  Top 0.406: J3.1 80.64,26.04 87.63,33.02 87.63,100.33 U$31.3/CANTX
MARKER_BUTTON
  Top 0.406: J3.7 79.8,33.66 81.37,32.08 83.73,32.08 85.39,33.75 85.39,74.63 82.55,77.47 82.55,85.09 74.93,92.71 74.93,110.49 U$31.4/CANRX
N$1  (1 unrouted)
PENC_A
  Top 0.406: DIFF_LINE_REC.3 57.15,59.69 54.69,62.15 54.69,87.55 U$33.24
PENC_B
  Top 0.406: U$33.25 52.15,87.55 52.15,62.63 57.63,57.15 DIFF_LINE_REC.5
PENC_CHA
  Top 0.406: DIFF_LINE_REC.2 61.74,60.96 62.59,61.8 62.59,63.86 66.89,68.16 74.08,68.16 76.2,66.04 J1.3
PENC_CHA/
  Top 0.406: J1.6 66.67,69.22 62.03,64.57 62.03,63.12 DIFF_LINE_REC.1
PENC_CHB  (via drill 0.35)
  Top 0.406: DIFF_LINE_REC.6 61.74,55.88 62.59,56.72 62.59,61.01 63.14,61.57 63.14,63.14 v65.62,65.62
  Bottom 0.406: J1.4 76.2,67.31 74.51,65.62 v65.62,65.62
PENC_CHB/
  Top 0.406: J1.5 67.94,66.67 63.7,62.43 63.7,62.23 63.7,61.34 63.14,60.78 63.14,56.01 61.74,54.61 DIFF_LINE_REC.7
PMOT_CS  (via drill 0.35)
  Top 0.406: v55.88,76.2 59.69,76.2 60.96,77.47 U$33.16/A2 | U$28.M1CS 33.27,72.64 v36.83,76.2
  Bottom 0.406: v36.83,76.2 v55.88,76.2
PMOT_INA
  Bottom 0.406: U$28.M1INA 43.43,67.31 54.61,67.31 U$33.18/A4/SDA
PMOT_INB
  Bottom 0.406: U$28.M1INB 42.16,66.04 57.15,66.04 68.58,77.47 U$33.19/A5/SCL
PMOT_PWM
  Bottom 0.406: U$33.22/A8 74.93,80.01 63.23,80.01 62.23,79.02 62.23,77.47 57.15,72.39 38.35,72.39 U$28.M1PWM
RBRAKE_PRESSURE
  Top 0.406: R3.2 R4.2
  Bottom 0.406: R4.2 16.51,81.28 25.4,81.28 | U$33.34/A15 27.94,81.28 25.4,81.28 | U$31.34/A15 29.21,95.25 29.21,85.09 25.4,81.28
RBRAKE_PRESSURE_W/O_RES  (1 unrouted)
  Top 0.406: BRAKE_PRESSURE.4_B 1.22,20.37 1.22,78.69 R3.1
RWHEELS_SPEED  (via drill 0.35)  (1 unrouted)
  Top 0.406: v55.88,62.23 67.31,73.66 67.31,92.71 U$33.6 69.85,95.25 69.85,110.49 U$31.6 | WHEEL_SPEED.3_A v19.05,62.23
  Bottom 0.406: v55.88,62.23 v19.05,62.23
SENC_A
  Top 0.406: DIFF_LINE_REC.11 65.26,55.88 64.26,54.88 64.26,53.34 61.72,50.8 58.42,50.8 47.17,62.05 47.17,87.45 43.18,91.44 U$33.26
SENC_B
  Top 0.406: DIFF_LINE_REC.13 65.26,58.42 63.7,56.87 63.7,54.03 62.23,52.56 59.2,52.56 49.61,62.15 49.61,87.55 44.45,92.71 44.45,94.25 43.63,95.07 41.73,95.07 U$33.27
SENC_CHA
  Top 0.406: J2.3 74.93,47.62 74.93,53.34 73.66,54.61 DIFF_LINE_REC.10
SENC_CHA/
  Top 0.406: DIFF_LINE_REC.9 70.48,53.34 J2.6
SENC_CHB
  Top 0.406: J2.4 77.47,50.16 77.47,52.07 69.85,59.69 DIFF_LINE_REC.14
SENC_CHB/  (via drill 0.35)
  Top 0.406: v72.39,58.42 69.85,60.96 DIFF_LINE_REC.15
  Bottom 0.406: J2.5 72.39,48.9 v72.39,58.42
SMOT_CS  (via drill 0.35)
  Top 0.406: U$33.17/A3 63.5,77.47 60.96,74.93 v55.88,74.93
  Bottom 0.406: U$28.M2CS 25.65,74.93 v55.88,74.93
SMOT_INA
  Bottom 0.406: U$28.M2INA 33.27,64.77 57.15,64.77 U$33.20/A6
SMOT_INB
  Bottom 0.406: U$28.M2INB 32,63.5 58.42,63.5 U$33.21/A7
SMOT_PWM
  Bottom 0.406: U$33.23/A9 76.2,81.28 61.95,81.28 59.69,79.02 59.69,77.47 55.88,73.66 26.92,73.66 U$28.M2PWM
UPSHIFT_LED  (1 unrouted)
UPSHIFT_LED_12V
  Top 0.406: LEVEL_SHIFT.13 72.52,29.97 J3.6